# EAGLE schematic DRV8839 (EAGLE 6.5.0)
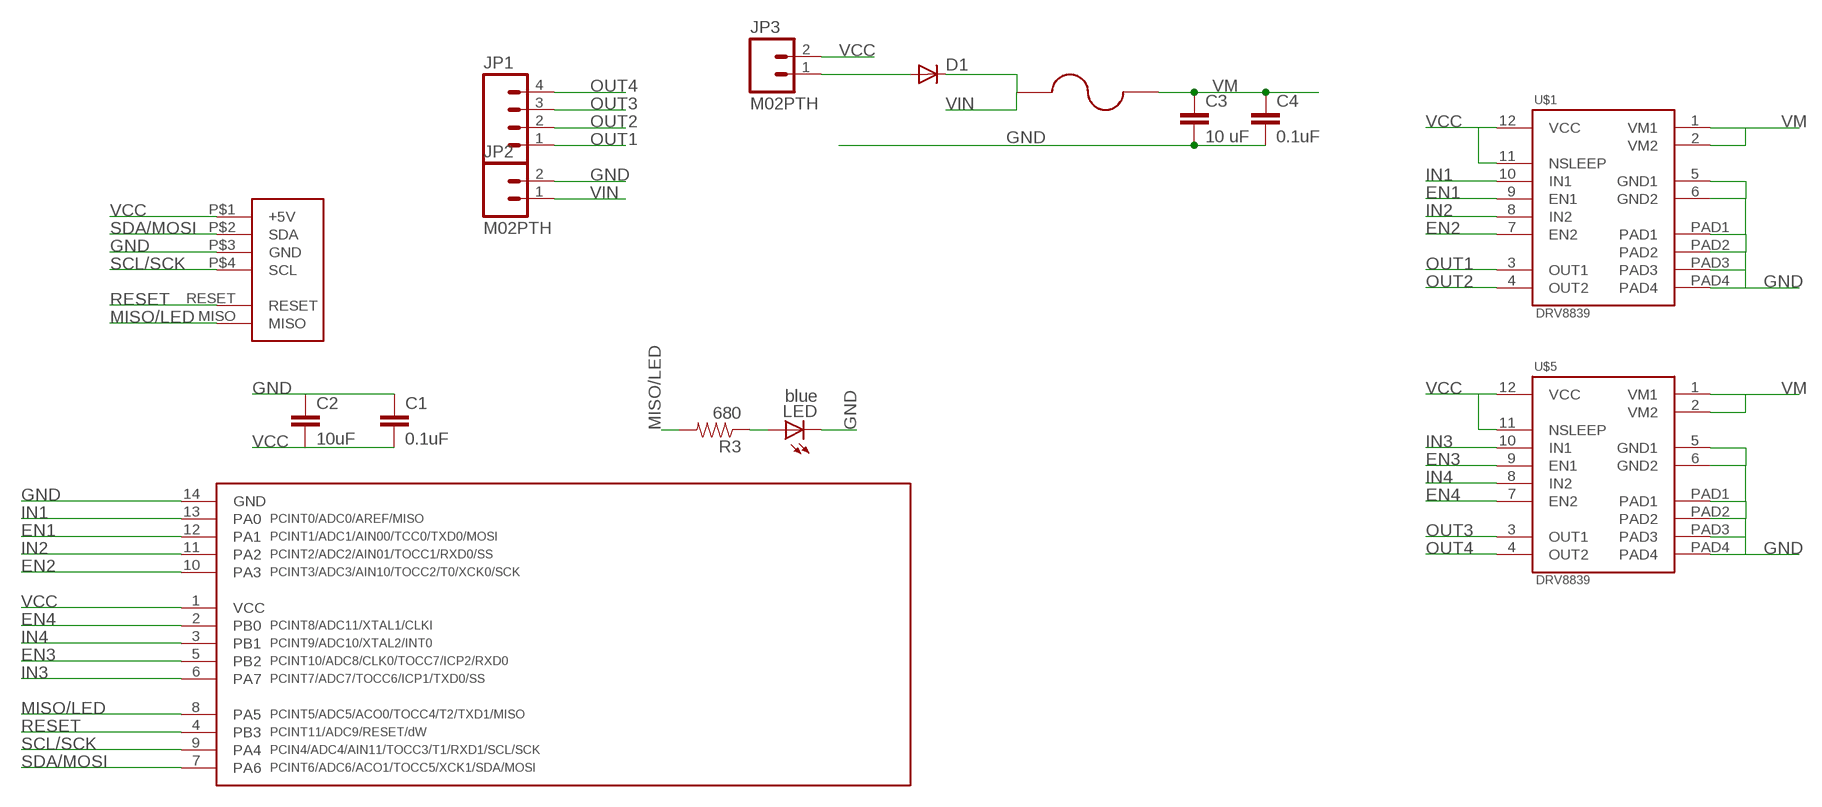
[diagram p0: schematic, sheet 1]

## Parts
C1  0.1uF  CAP0805  [0805]
C2  10uF  CAP0805  [0805]
C3  10 uF  CAP0805  [0805]
C4  0.1uF  CAP0805  [0805]
D1  DIODESMC/DO-214AB  [SMC]
JP1  M04PTH  [1X04]
JP2  M02PTH  [1X02]
JP3  M02PTH  [1X02]
LED  blue  LEDCHIPLED_1206  [CHIPLED_1206]
R3  680  RESISTOR0805-RES  [0805]
U$1  DRV8839  [WSON-POWERPAD-12]
U$2  FUSE  [1812]
U$3  TINY841  [SOIC14]
U$4  FOOTPRINT  [FOOTPRINT]
U$5  DRV8839  [WSON-POWERPAD-12]

## Nets
EN1: U$1.9(EN1) U$3.12(PA1)
EN2: U$1.7(EN2) U$3.10(PA3)
EN3: U$3.5(PB2) U$5.9(EN1)
EN4: U$3.2(PB0) U$5.7(EN2)
GND: C1.1 C2.1 C3.2 C4.2 JP2.2 LED.C U$1.5(GND1) U$1.6(GND2) U$1.PAD1 U$1.PAD2 U$1.PAD3 U$1.PAD4 U$3.14(GND) U$4.P$3(GND) U$5.5(GND1) U$5.6(GND2) U$5.PAD1 U$5.PAD2 U$5.PAD3 U$5.PAD4
IN1: U$1.10(IN1) U$3.13(PA0)
IN2: U$1.8(IN2) U$3.11(PA2)
IN3: U$3.6(PA7) U$5.10(IN1)
IN4: U$3.3(PB1) U$5.8(IN2)
MISO/LED: R3.2 U$3.8(PA5) U$4.MISO
N$3: D1.A JP3.1
N$5: LED.A R3.1
OUT1: JP1.1 U$1.3(OUT1)
OUT2: JP1.2 U$1.4(OUT2)
OUT3: JP1.3 U$5.3(OUT1)
OUT4: JP1.4 U$5.4(OUT2)
RESET: U$3.4(PB3) U$4.RESET
SCL/SCK: U$3.9(PA4) U$4.P$4(SCL)
SDA/MOSI: U$3.7(PA6) U$4.P$2(SDA)
VCC: C1.2 C2.2 JP3.2 U$1.11(NSLEEP) U$1.12(VCC) U$3.1(VCC) U$4.P$1(+5V) U$5.11(NSLEEP) U$5.12(VCC)
VIN: D1.C JP2.1 U$2.P$1
VM: C3.1 C4.1 U$1.1(VM1) U$1.2(VM2) U$2.P$2 U$5.1(VM1) U$5.2(VM2)

## Library data of the parts
C1-C4 = SparkFun-Capacitors:CAP: Capacitor Standard 0603 ceramic capacitor, and 0.1" leaded capacitor.
D1 = SparkFun-DiscreteSemi:DIODE: Diode These are standard reverse protection diodes and small signal diodes. SMA package can handle up to about 1A. SOD-323 can handle about 200mA. What the SOD-323 package when ordering, there are some mfgs out there that are 5-pin packages.
JP1 = SparkFun-Connectors:M04: Header 4 Standard 4-pin 0.1" header. Use with straight break away headers (SKU : PRT-00116), right angle break away headers (PRT-00553), swiss pins (PRT-00743), machine pins (PRT-00117), and female headers (PRT-00115). Molex polarized connector foot print use with SKU : PRT-08231 with associated crimp pins and housings. 1MM SMD Version SKU: PRT-10208
JP2 JP3 = SparkFun-Connectors:M02: Standard 2-pin 0.1" header. Use with - straight break away headers ( PRT-00116) - right angle break away headers (PRT-00553) - swiss pins (PRT-00743) - machine pins (PRT-00117) - female headers (PRT-00115) Molex polarized connector foot print use with: PRT-08233 with associated crimp pins and housings. 2.54_SCREWTERM for use with PRT-10571. 3.5mm Screw Terminal footprints for PRT-08084 5mm Screw Terminal footprints for use with PRT-08433
LED = led:LED: LED OSRAM: - CHIPLED LG R971, LG N971, LY N971, LG Q971, LY Q971, LO R971, LY R971 LH N974, LH R974 LS Q976, LO Q976, LY Q976 LO Q996 - Hyper CHIPLED LW Q18S LB Q993, LB Q99A, LB R99A - SideLED LS A670, LO A670, LY A670, LG A670, LP A670 LB A673, LV A673, LT A673, LW A673 LH A674 LY A675 LS A676, LA A676, LO A676, LY A676, LW A676 LS A679, LY A679, LG A679 - Hyper Micro SIDELED® LS Y876, LA Y876, LO Y876, LY Y876 LT Y87S - SmartLED LW L88C, LW L88S LB L89C, LB L89S, LG L890 LS L89K, LO L89K, LY L89K LS L896, LA L896, LO L896, LY L896 - TOPLED LS T670, LO T670, LY T670, LG T670, LP T670 LSG T670, LSP T670, LSY T670, LOP T670, LYG T670 LG T671, LOG T671, LSG T671 LB T673, LV T673, LT T673, LW T673 LH T674 LS T676, LA T676, LO T676, LY T676, LB T676, LH T676, LSB T676, LW T676 LB T67C, LV T67C, LT T67C, LS T67K, LO T67K, LY T67K, LW E67C LS E67B, LA E67B, LO E67B, LY E67B, LB E67C, LV E67C, LT E67C LW T67C LS T679, LY T679, LG T679 LS T770, LO T770, LY T770, LG T770, LP T770 LB T773, LV T773, LT T773, LW T773 LH T774 LS E675, LA E675, LY E675, LS T675 LS T776, LA T776, LO T776, LY T776, LB T776 LHGB T686 LT T68C, LB T68C - Hyper Mini TOPLED® LB M676 - Mini TOPLED Santana® LG M470 LS M47K, LO M47K, LY M47K Source: http://www.osram.convergy.de LUXEON: - LUMILED® LXK2-PW12-R00, LXK2-PW12-S00, LXK2-PW14-U00, LXK2-PW14-V00 LXK2-PM12-R00, LXK2-PM12-S00, LXK2-PM14-U00 LXK2-PE12-Q00, LXK2-PE12-R00, LXK2-PE12-S00, LXK2-PE14-T00, LXK2-PE14-U00 LXK2-PB12-K00, LXK2-PB12-L00, LXK2-PB12-M00, LXK2-PB14-N00, LXK2-PB14-P00, LXK2-PB14-Q00 LXK2-PR12-L00, LXK2-PR12-M00, LXK2-PR14-Q00, LXK2-PR14-R00 LXK2-PD12-Q00, LXK2-PD12-R00, LXK2-PD12-S00 LXK2-PH12-R00, LXK2-PH12-S00 LXK2-PL12-P00, LXK2-PL12-Q00, LXK2-PL12-R00 Source: www.luxeon.com KINGBRIGHT: KA-3528ASYC Source: www.kingbright.com
R3 = SparkFun-Passives:RESISTOR: Resistor Basic schematic elements and footprints for 0603, 1206, and PTH resistors.
U$1 U$5 = IntegerLabs:DRV8839
U$2 = IntegerLabs:FUSE
U$3 = IntegerLabs:TINY841
U$4 = IntegerLabs:FOOTPRINT